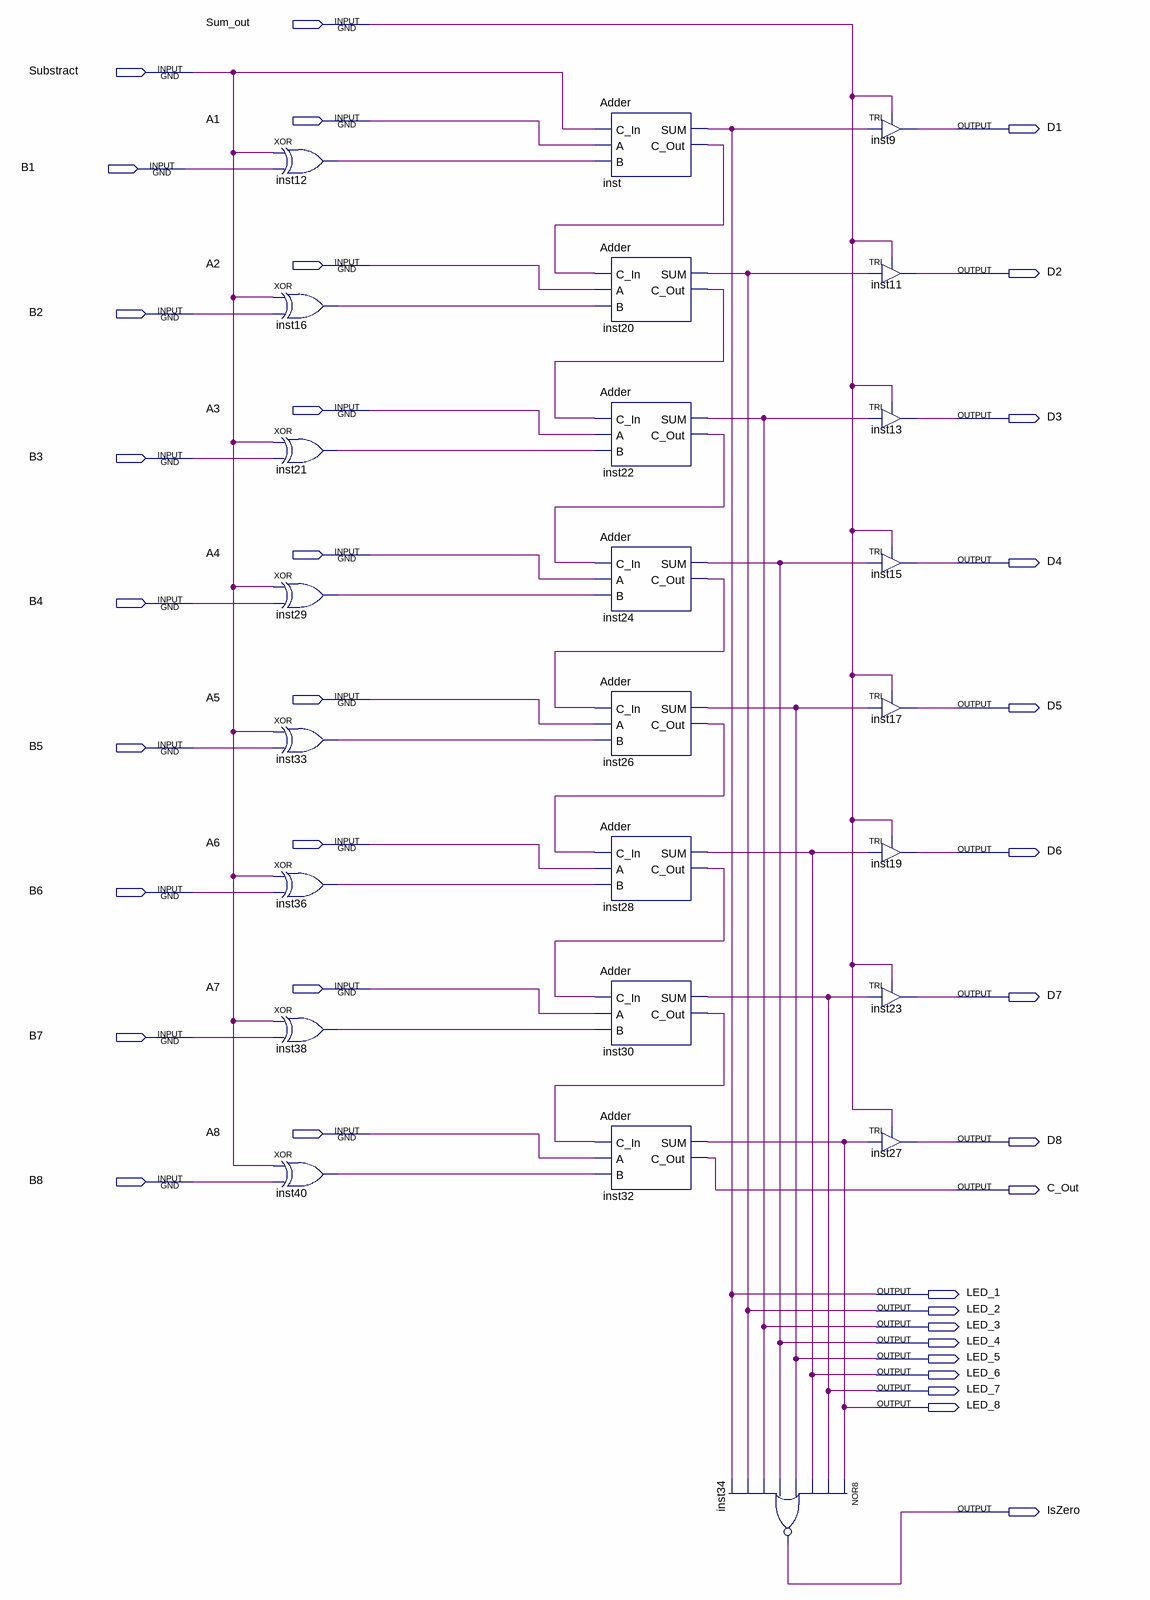
[diagram p0: schematic sheet]
// Quartus schematic ALU.bdf as structural Verilog: 25 symbols, 36 pins
module ALU (
  input  Sum_out,
  input  Substract,
  input  A1,
  input  B1,
  input  A2,
  input  B2,
  input  A3,
  input  B3,
  input  A4,
  input  B4,
  input  A5,
  input  B5,
  input  A6,
  input  B6,
  input  A7,
  input  B7,
  input  A8,
  input  B8,
  output D1,
  output D2,
  output D3,
  output D4,
  output D5,
  output D6,
  output D7,
  output D8,
  output C_Out,
  output LED_1,
  output LED_2,
  output LED_3,
  output LED_4,
  output LED_5,
  output LED_6,
  output LED_7,
  output LED_8,
  output IsZero
);

  wire inst12_out, inst16_out, inst20_c_out, inst21_out, inst22_c_out, inst24_c_out, inst26_c_out,
       inst28_c_out, inst29_out, inst30_c_out, inst33_out, inst36_out, inst38_out, inst40_out, inst_c_out;

  xor inst12 (inst12_out, Substract, B1);
  xor inst16 (inst16_out, Substract, B2);
  xor inst21 (inst21_out, Substract, B3);
  xor inst29 (inst29_out, Substract, B4);
  xor inst33 (inst33_out, Substract, B5);
  xor inst36 (inst36_out, Substract, B6);
  xor inst38 (inst38_out, Substract, B7);
  xor inst40 (inst40_out, Substract, B8);
  Adder inst (.C_In(Substract), .A(A1), .B(inst12_out), .SUM(LED_1), .C_Out(inst_c_out));
  Adder inst20 (.C_In(inst_c_out), .A(A2), .B(inst16_out), .SUM(LED_2), .C_Out(inst20_c_out));
  Adder inst22 (.C_In(inst20_c_out), .A(A3), .B(inst21_out), .SUM(LED_3), .C_Out(inst22_c_out));
  Adder inst24 (.C_In(inst22_c_out), .A(A4), .B(inst29_out), .SUM(LED_4), .C_Out(inst24_c_out));
  Adder inst26 (.C_In(inst24_c_out), .A(A5), .B(inst33_out), .SUM(LED_5), .C_Out(inst26_c_out));
  Adder inst28 (.C_In(inst26_c_out), .A(A6), .B(inst36_out), .SUM(LED_6), .C_Out(inst28_c_out));
  Adder inst30 (.C_In(inst28_c_out), .A(A7), .B(inst38_out), .SUM(LED_7), .C_Out(inst30_c_out));
  Adder inst32 (.C_In(inst30_c_out), .A(A8), .B(inst40_out), .SUM(LED_8), .C_Out(C_Out));
  nor inst34 (IsZero, LED_8, LED_7, LED_6, LED_5, LED_4, LED_3, LED_2, LED_1);
  TRI inst9 (.IN(LED_1), .OE(Sum_out), .OUT(D1));
  TRI inst11 (.IN(LED_2), .OE(Sum_out), .OUT(D2));
  TRI inst13 (.IN(LED_3), .OE(Sum_out), .OUT(D3));
  TRI inst15 (.IN(LED_4), .OE(Sum_out), .OUT(D4));
  TRI inst17 (.IN(LED_5), .OE(Sum_out), .OUT(D5));
  TRI inst19 (.IN(LED_6), .OE(Sum_out), .OUT(D6));
  TRI inst23 (.IN(LED_7), .OE(Sum_out), .OUT(D7));
  TRI inst27 (.IN(LED_8), .OE(Sum_out), .OUT(D8));
endmodule
